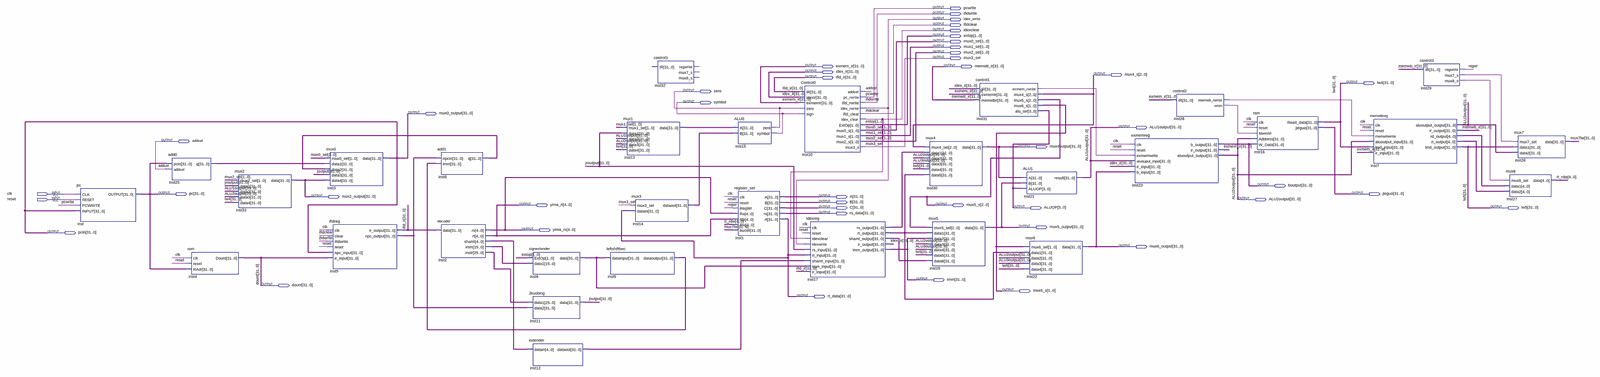
[diagram p0: schematic sheet, whole]
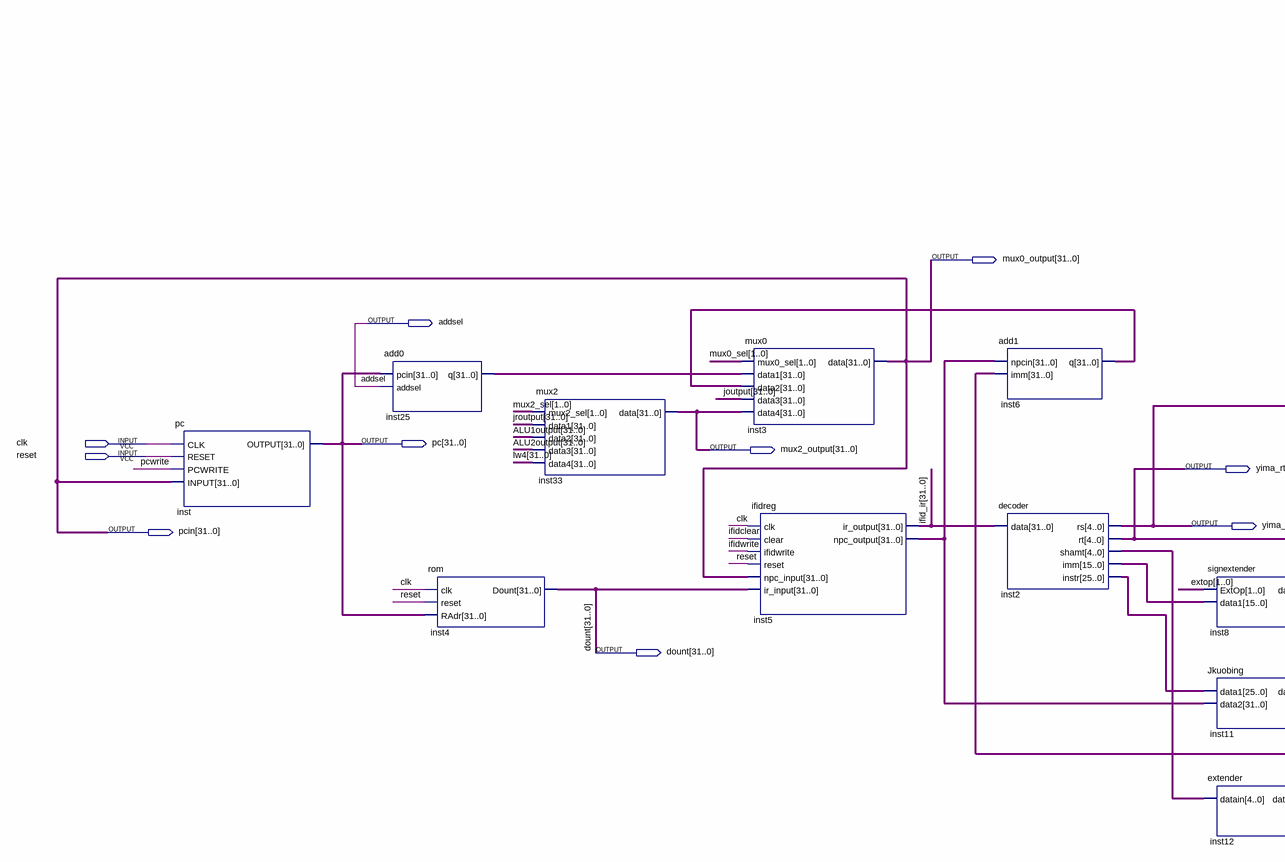
[diagram p1: schematic sheet, left part]
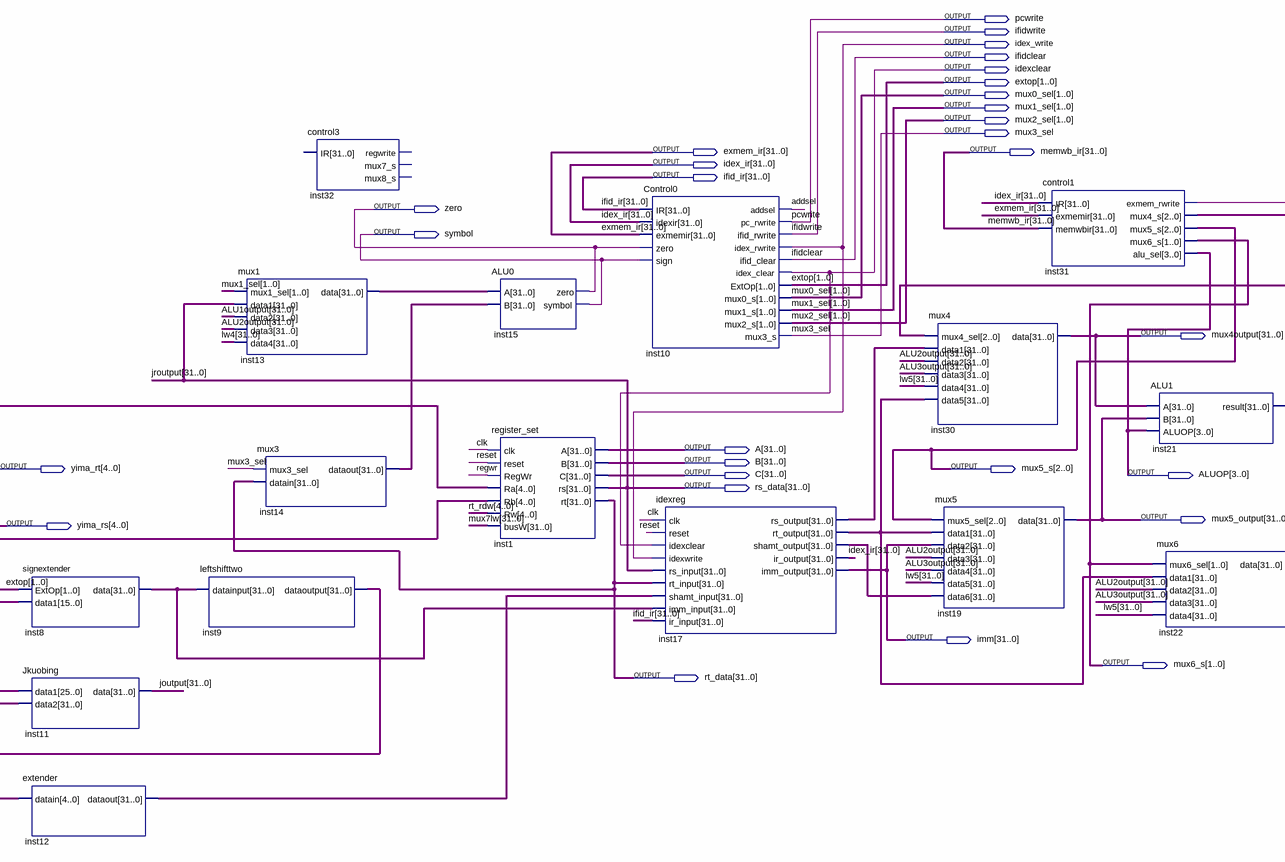
[diagram p2: schematic sheet, centre part]
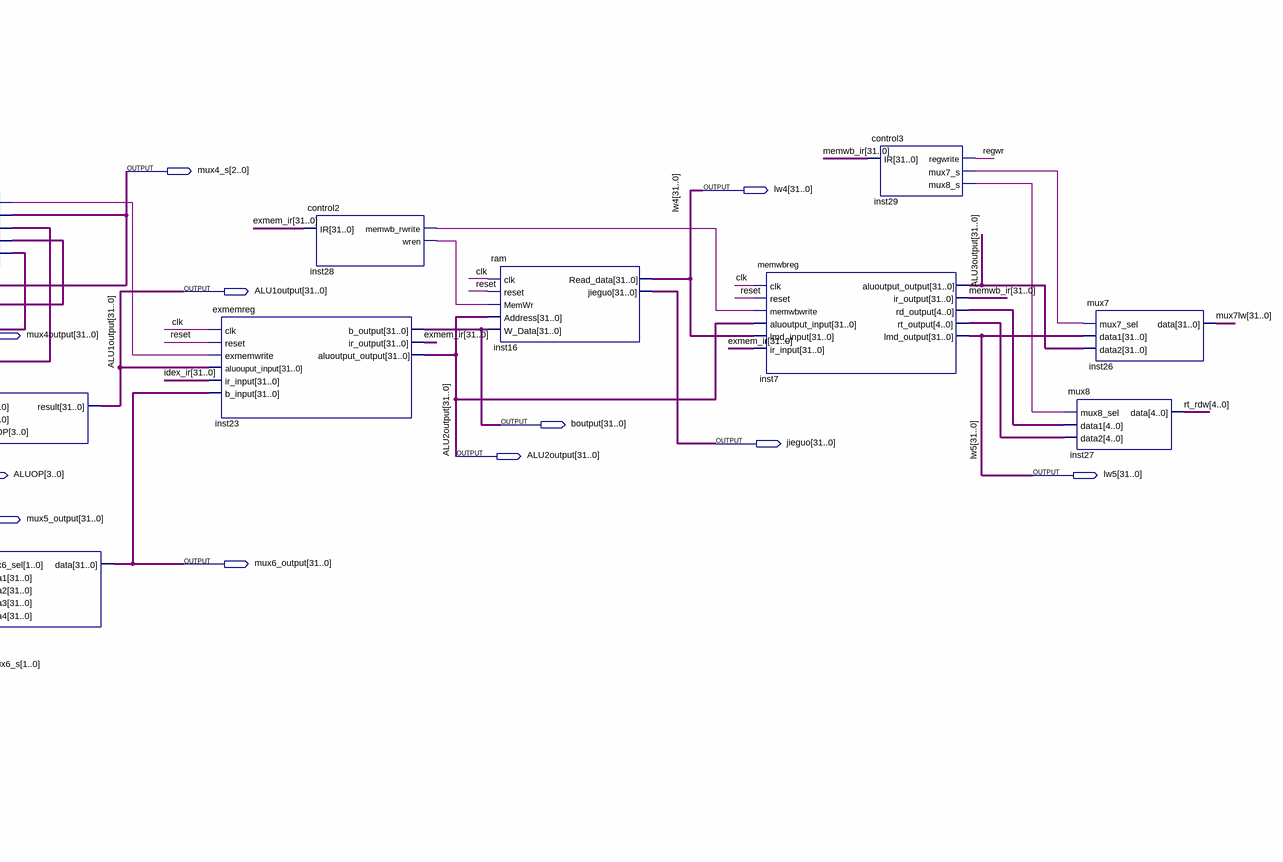
[diagram p3: schematic sheet, right part]
// Quartus schematic zhong.bdf as structural Verilog: 31 symbols, 45 pins
module zhong (
  input  clk,
  input  reset,
  output pcwrite,
  output ifidwrite,
  output idex_write,
  output ifidclear,
  output idexclear,
  output [1:0] extop,
  output [1:0] mux0_sel,
  output [1:0] mux1_sel,
  output [1:0] mux2_sel,
  output mux3_sel,
  output [31:0] exmem_ir,
  output [31:0] memwb_ir,
  output [31:0] idex_ir,
  output [2:0] mux4_s,
  output [31:0] ifid_ir,
  output [31:0] lw4,
  output zero,
  output symbol,
  output [31:0] mux0_output,
  output [31:0] ALU1output,
  output addsel,
  output [31:0] mux4output,
  output [31:0] boutput,
  output [31:0] pc,
  output [31:0] jieguo,
  output [31:0] mux2_output,
  output [31:0] A,
  output [31:0] ALU2output,
  output [31:0] B,
  output [4:0] yima_rt,
  output [2:0] mux5_s,
  output [31:0] C,
  output [3:0] ALUOP,
  output [31:0] lw5,
  output [31:0] rs_data,
  output [31:0] mux5_output,
  output [4:0] yima_rs,
  output [31:0] pcin,
  output [31:0] mux6_output,
  output [31:0] imm,
  output [31:0] dount,
  output [1:0] mux6_s,
  output [31:0] rt_data
);

  wire inst28_memwb_rwrite, inst28_wren, inst29_mux7_s, inst29_mux8_s, inst31_exmem_rwrite, regwr;
  wire [4:0] inst2_shamt, inst7_rd_output, inst7_rt_output, rt_rdw;
  wire [15:0] inst2_imm;
  wire [25:0] inst2_instr;
  wire [31:0] ALU3output, inst5_npc_output, inst6_q, inst8_data, inst9_dataoutput, inst12_dataout,
       inst13_data, inst14_dataout, inst17_rs_output, inst17_rt_output, inst17_shamt_output, inst25_q,
       joutput, mux7lw;

  pc inst (.CLK(clk), .RESET(reset), .PCWRITE(pcwrite), .INPUT(mux0_output), .OUTPUT(pc));
  add0 inst25 (.pcin(pc), .addsel(addsel), .q(inst25_q));
  rom inst4 (.clk(clk), .reset(reset), .RAdr(pc), .Dount(dount));
  mux2 inst33 (
    .mux2_sel(mux2_sel), .data1(rs_data), .data2(ALU1output), .data3(ALU2output), .data4(lw4),
    .data(mux2_output));
  mux0 inst3 (
    .mux0_sel(mux0_sel), .data1(inst25_q), .data2(inst6_q), .data3(joutput), .data4(mux2_output),
    .data(mux0_output));
  ifidreg inst5 (
    .clk(clk), .clear(ifidclear), .ifidwrite(ifidwrite), .reset(reset), .npc_input(mux0_output),
    .ir_input(dount), .ir_output(ifid_ir), .npc_output(inst5_npc_output));
  add1 inst6 (.npcin(inst5_npc_output), .imm(inst9_dataoutput), .q(inst6_q));
  decoder inst2 (.data(ifid_ir), .rs(yima_rs), .rt(yima_rt), .shamt(inst2_shamt), .imm(inst2_imm), .instr(inst2_instr));
  signextender inst8 (.ExtOp(extop), .data1(inst2_imm), .data(inst8_data));
  Jkuobing inst11 (.data1(inst2_instr), .data2(inst5_npc_output), .data(joutput));
  extender inst12 (.datain(inst2_shamt), .dataout(inst12_dataout));
  leftshifttwo inst9 (.datainput(inst8_data), .dataoutput(inst9_dataoutput));
  mux1 inst13 (
    .mux1_sel(mux1_sel), .data1(rs_data), .data2(ALU1output), .data3(ALU2output), .data4(lw4),
    .data(inst13_data));
  mux3 inst14 (.mux3_sel(mux3_sel), .datain(rt_data), .dataout(inst14_dataout));
  control3 inst32 ();  // open: IR, regwrite, mux7_s, mux8_s
  ALU0 inst15 (.A(inst13_data), .B(inst14_dataout), .zero(zero), .symbol(symbol));
  register_set inst1 (
    .clk(clk), .reset(reset), .RegWr(regwr), .Ra(yima_rs), .Rb(yima_rt), .Rw(rt_rdw), .busW(mux7lw), .A(A),
    .B(B), .C(C), .rs(rs_data), .rt(rt_data));
  Control0 inst10 (
    .IR(ifid_ir), .idexir(idex_ir), .exmemir(exmem_ir), .zero(zero), .sign(symbol), .addsel(addsel),
    .pc_rwrite(pcwrite), .ifid_rwrite(ifidwrite), .idex_rwrite(idex_write), .ifid_clear(ifidclear),
    .idex_clear(idexclear), .ExtOp(extop), .mux0_s(mux0_sel), .mux1_s(mux1_sel), .mux2_s(mux2_sel),
    .mux3_s(mux3_sel));
  idexreg inst17 (
    .clk(clk), .reset(reset), .idexclear(idexclear), .idexwrite(idex_write), .rs_input(rs_data),
    .rt_input(rt_data), .shamt_input(inst12_dataout), .imm_input(inst8_data), .ir_input(ifid_ir),
    .rs_output(inst17_rs_output), .rt_output(inst17_rt_output), .shamt_output(inst17_shamt_output),
    .ir_output(idex_ir), .imm_output(imm));
  mux4 inst30 (
    .mux4_sel(mux4_s), .data1(inst17_rs_output), .data2(ALU2output), .data3(ALU3output), .data4(lw5),
    .data5(inst17_rt_output), .data(mux4output));
  mux5 inst19 (
    .mux5_sel(mux5_s), .data1(inst17_rt_output), .data2(imm), .data3(ALU2output), .data4(ALU3output),
    .data5(lw5), .data6(inst17_shamt_output), .data(mux5_output));
  control1 inst31 (
    .IR(idex_ir), .exmemir(exmem_ir), .memwbir(memwb_ir), .exmem_rwrite(inst31_exmem_rwrite),
    .mux4_s(mux4_s), .mux5_s(mux5_s), .mux6_s(mux6_s), .alu_sel(ALUOP));
  ALU1 inst21 (.A(mux4output), .B(mux5_output), .ALUOP(ALUOP), .result(ALU1output));
  mux6 inst22 (
    .mux6_sel(mux6_s), .data1(inst17_rt_output), .data2(ALU2output), .data3(ALU3output), .data4(lw5),
    .data(mux6_output));
  exmemreg inst23 (
    .clk(clk), .reset(reset), .exmemwrite(inst31_exmem_rwrite), .aluouput_input(ALU1output),
    .ir_input(idex_ir), .b_input(mux6_output), .b_output(boutput), .ir_output(exmem_ir),
    .aluoutput_output(ALU2output));
  control2 inst28 (.IR(exmem_ir), .memwb_rwrite(inst28_memwb_rwrite), .wren(inst28_wren));
  ram inst16 (
    .clk(clk), .reset(reset), .MemWr(inst28_wren), .Address(ALU2output), .W_Data(boutput), .Read_data(lw4),
    .jieguo(jieguo));
  memwbreg inst7 (
    .clk(clk), .reset(reset), .memwbwrite(inst28_memwb_rwrite), .aluoutput_input(ALU2output),
    .lmd_input(lw4), .ir_input(exmem_ir), .aluoutput_output(ALU3output), .ir_output(memwb_ir),
    .rd_output(inst7_rd_output), .rt_output(inst7_rt_output), .lmd_output(lw5));
  control3 inst29 (.IR(memwb_ir), .regwrite(regwr), .mux7_s(inst29_mux7_s), .mux8_s(inst29_mux8_s));
  mux7 inst26 (.mux7_sel(inst29_mux7_s), .data1(lw5), .data2(ALU3output), .data(mux7lw));
  mux8 inst27 (.mux8_sel(inst29_mux8_s), .data1(inst7_rd_output), .data2(inst7_rt_output), .data(rt_rdw));

  assign pcin = mux0_output;

  // Other names for the same wires on the sheet: jroutput[31:0] = rs_data
endmodule
